# Altium schematic sheet curvas.SchDoc
size 127 x 114 mm; PageSetup: Record=PageOptions|CenterHorizontal=True|CenterVertical=True|PrintScale=1.05|XCorrection=1.00|YCorrection=1.00|PrintKind=0|BorderSize=5000000|LeftOffset=0|BottomOffset=0|Orientation=2|PaperLength=1000|PaperWidth=1000|Scale=100|PaperSource=7|PrintQuality=-4|MediaType=1|DitherType=10|PaperKind=A4 (8.2 x 11.7 in; 210 x 297 mm)|PrintScaleMode=1
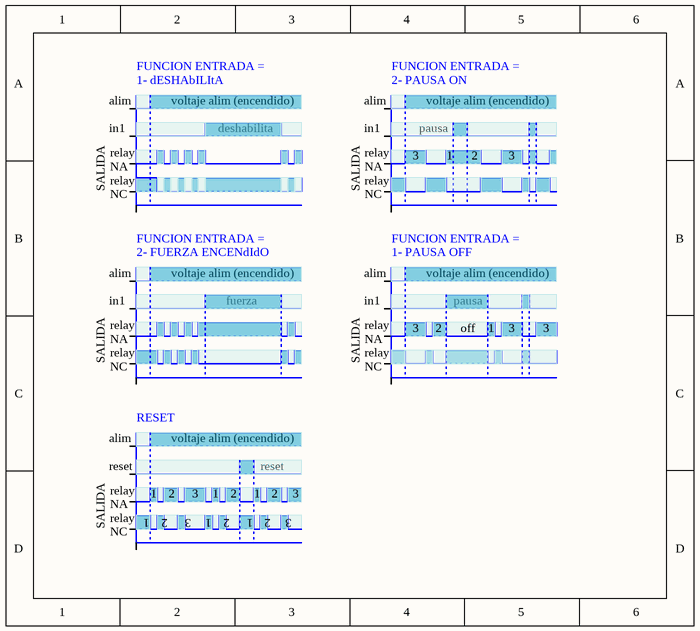
[diagram p0: curvas.SchDoc]

## Notes on the sheet
- alim
- 1- dESHAbILItA
- FUNCION ENTRADA =
- voltaje alim (encendido)
- 2- PAUSA ON
- relay
  NA
- in1
- deshabilita
- 3
- pausa
- 1
- 2
- relay
  NC
- SALIDA
- 2- FUERZA ENCENdIdO
- fuerza
- 1- PAUSA OFF
- off
- RESET
- reset